# EAGLE schematic TESTED_Midi2PO (EAGLE 9.6.2)
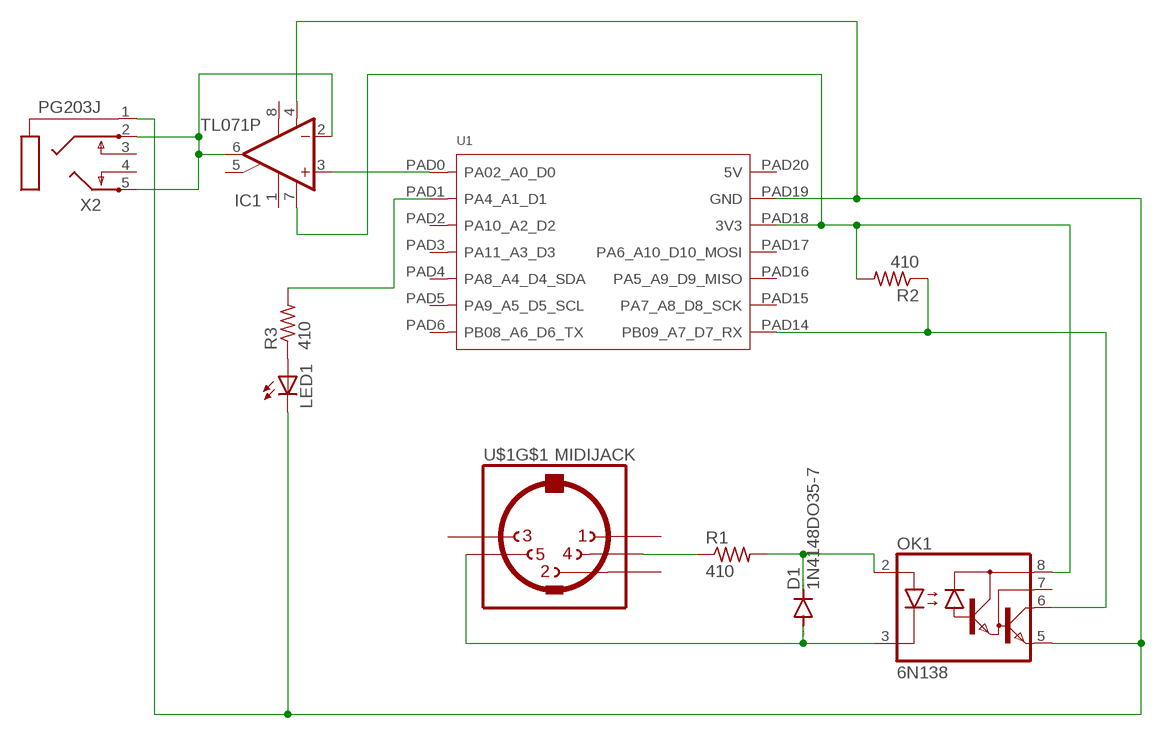
[diagram p0: schematic, sheet 1]

## Parts
D1  1N4148DO35-7  [DO35-7]
IC1  TL071P  [DIL08]
LED1  LED5MM  [LED5MM]
OK1  6N138  [DIL08]
R1  410  R-US_0207/9  [0207/9]
R2  410  R-US_0207/9  [0207/9]
R3  410  R-US_0207/9  [0207/9]
U1  MOUDLE-SEEEDUINO-XIAO  [MOUDLE14P-2.54-21X17.8MM]
U$1  MIDIJACK  [CP-2350]
X2  PG203J  [PG203J]

## Nets
N$1: D1.C OK1.2(A) R1.2
N$2: R1.1 U$1.4
N$3: D1.A OK1.3(C) U$1.5
N$4: IC1.4(V-) LED1.K(C) OK1.5(GND) U1.PAD19(GND) X2.1
N$5: OK1.6(VO) R2.1 U1.PAD14(PB09_A7_D7_RX)
N$6: IC1.7(V+) OK1.8(VCC) R2.2 U1.PAD18(3V3)
N$7: IC1.3(+IN) U1.PAD0(PA02_A0_D0)
N$8: LED1.A R3.1
N$9: R3.2 U1.PAD1(PA4_A1_D1)
N$11: IC1.2(-IN) IC1.6(OUT) X2.2 X2.5
Unconnected: IC1.1(ON1) IC1.5(ON2) IC1.8(OPT) OK1.7(VB) U1.PAD2(PA10_A2_D2) U1.PAD3(PA11_A3_D3) U1.PAD4(PA8_A4_D4_SDA) U1.PAD5(PA9_A5_D5_SCL) U1.PAD6(PB08_A6_D6_TX) U1.PAD15(PA7_A8_D8_SCK) U1.PAD16(PA5_A9_D9_MISO) U1.PAD17(PA6_A10_D10_MOSI) U1.PAD20(5V) U$1.1 U$1.2 U$1.3 U$1.PE1(MT) U$1.PE2(MT) U$1.PE(MT) U$1.PE@(MT) X2.3 X2.4

## Library data of the parts
D1 = diode:1N4148: DIODE high speed (Philips)
IC1 = linear:TL071: OP AMP
LED1 = adafruit:LED: LED OSRAM: - CHIPLED LG R971, LG N971, LY N971, LG Q971, LY Q971, LO R971, LY R971 LH N974, LH R974 LS Q976, LO Q976, LY Q976 LO Q996 - Hyper CHIPLED LW Q18S LB Q993, LB Q99A, LB R99A - SideLED LS A670, LO A670, LY A670, LG A670, LP A670 LB A673, LV A673, LT A673, LW A673 LH A674 LY A675 LS A676, LA A676, LO A676, LY A676, LW A676 LS A679, LY A679, LG A679 - Hyper Micro SIDELED® LS Y876, LA Y876, LO Y876, LY Y876 LT Y87S - SmartLED LW L88C, LW L88S LB L89C, LB L89S, LG L890 LS L89K, LO L89K, LY L89K LS L896, LA L896, LO L896, LY L896 - TOPLED LS T670, LO T670, LY T670, LG T670, LP T670 LSG T670, LSP T670, LSY T670, LOP T670, LYG T670 LG T671, LOG T671, LSG T671 LB T673, LV T673, LT T673, LW T673 LH T674 LS T676, LA T676, LO T676, LY T676, LB T676, LH T676, LSB T676, LW T676 LB T67C, LV T67C, LT T67C, LS T67K, LO T67K, LY T67K, LW E67C LS E67B, LA E67B, LO E67B, LY E67B, LB E67C, LV E67C, LT E67C LW T67C LS T679, LY T679, LG T679 LS T770, LO T770, LY T770, LG T770, LP T770 LB T773, LV T773, LT T773, LW T773 LH T774 LS E675, LA E675, LY E675, LS T675 LS T776, LA T776, LO T776, LY T776, LB T776 LHGB T686 LT T68C, LB T68C - Hyper Mini TOPLED® LB M676 - Mini TOPLED Santana® LG M470 LS M47K, LO M47K, LY M47K Source: http://www.osram.convergy.de/
OK1 = optocoupler:6N138: MOTOROLA OPTO COUPLER; MF: VISHAY/TELEFUNKEN; MPN: 6N138; OC_FARNELL: 9860150; OC_NEWARK: 35K5294
R1-R3 = adafruit:R-US_: RESISTOR, American symbol
U1 = Seeeduino XIAO_holes:MOUDLE-SEEEDUINO-XIAO
U$1 = adafruit:MIDIJACK: DIN 5 jack also known as MIDI jack A modification of conn-hirshman:MAB5SH with two options for the grounding 'teeth'
X2 = con-hirschmann:PG203J: MIC/HEADPHONE JACK KS-S stereo microphone/headphone jack PG203JN (Schukat); OC_FARNELL: unknown; OC_NEWARK: unknown